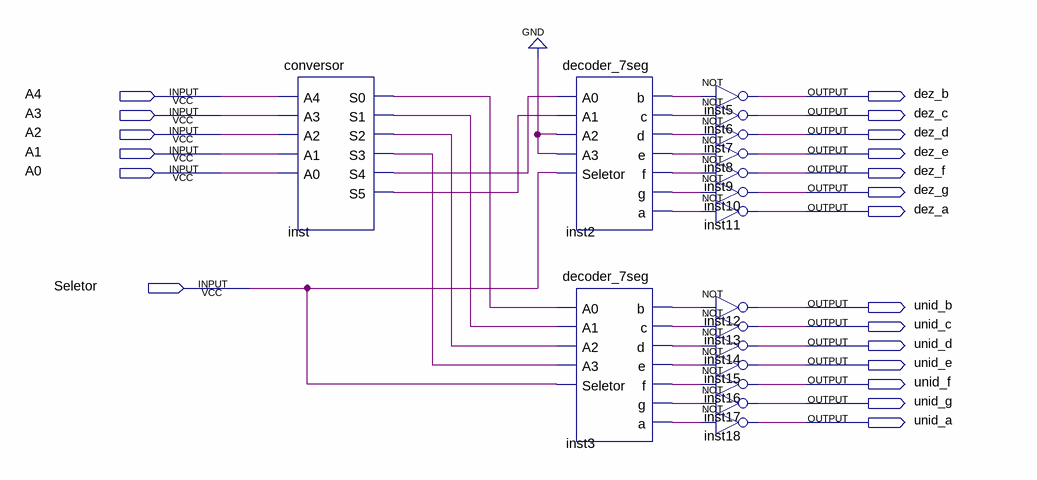
[diagram p0: schematic sheet]
// Quartus schematic Decodificador.bdf as structural Verilog: 17 symbols, 20 pins
module Decodificador (
  input  A4,
  input  A3,
  input  A2,
  input  A1,
  input  A0,
  input  Seletor,
  output dez_b,
  output dez_c,
  output dez_d,
  output dez_e,
  output dez_f,
  output dez_g,
  output dez_a,
  output unid_b,
  output unid_c,
  output unid_d,
  output unid_e,
  output unid_f,
  output unid_g,
  output unid_a
);

  wire inst2_a, inst2_b, inst2_c, inst2_d, inst2_e, inst2_f, inst2_g, inst3_a, inst3_b, inst3_c, inst3_d,
       inst3_e, inst3_f, inst3_g, inst_s0, inst_s1, inst_s2, inst_s3, inst_s4, inst_s5;

  conversor inst (
    .A4(A4), .A3(A3), .A2(A2), .A1(A1), .A0(A0), .S0(inst_s0), .S1(inst_s1), .S2(inst_s2), .S3(inst_s3),
    .S4(inst_s4), .S5(inst_s5));
  decoder_7seg inst2 (
    .A0(inst_s4), .A1(inst_s5), .A2(1'b0), .A3(1'b0), .Seletor(Seletor), .b(inst2_b), .c(inst2_c),
    .d(inst2_d), .e(inst2_e), .f(inst2_f), .g(inst2_g), .a(inst2_a));
  decoder_7seg inst3 (
    .A0(inst_s0), .A1(inst_s1), .A2(inst_s2), .A3(inst_s3), .Seletor(Seletor), .b(inst3_b), .c(inst3_c),
    .d(inst3_d), .e(inst3_e), .f(inst3_f), .g(inst3_g), .a(inst3_a));
  not inst5 (dez_b, inst2_b);
  not inst6 (dez_c, inst2_c);
  not inst7 (dez_d, inst2_d);
  not inst8 (dez_e, inst2_e);
  not inst9 (dez_f, inst2_f);
  not inst10 (dez_g, inst2_g);
  not inst11 (dez_a, inst2_a);
  not inst12 (unid_b, inst3_b);
  not inst13 (unid_c, inst3_c);
  not inst14 (unid_d, inst3_d);
  not inst15 (unid_e, inst3_e);
  not inst16 (unid_f, inst3_f);
  not inst17 (unid_g, inst3_g);
  not inst18 (unid_a, inst3_a);
endmodule
